# EAGLE design ramtotsop (EAGLE 9.6.2)
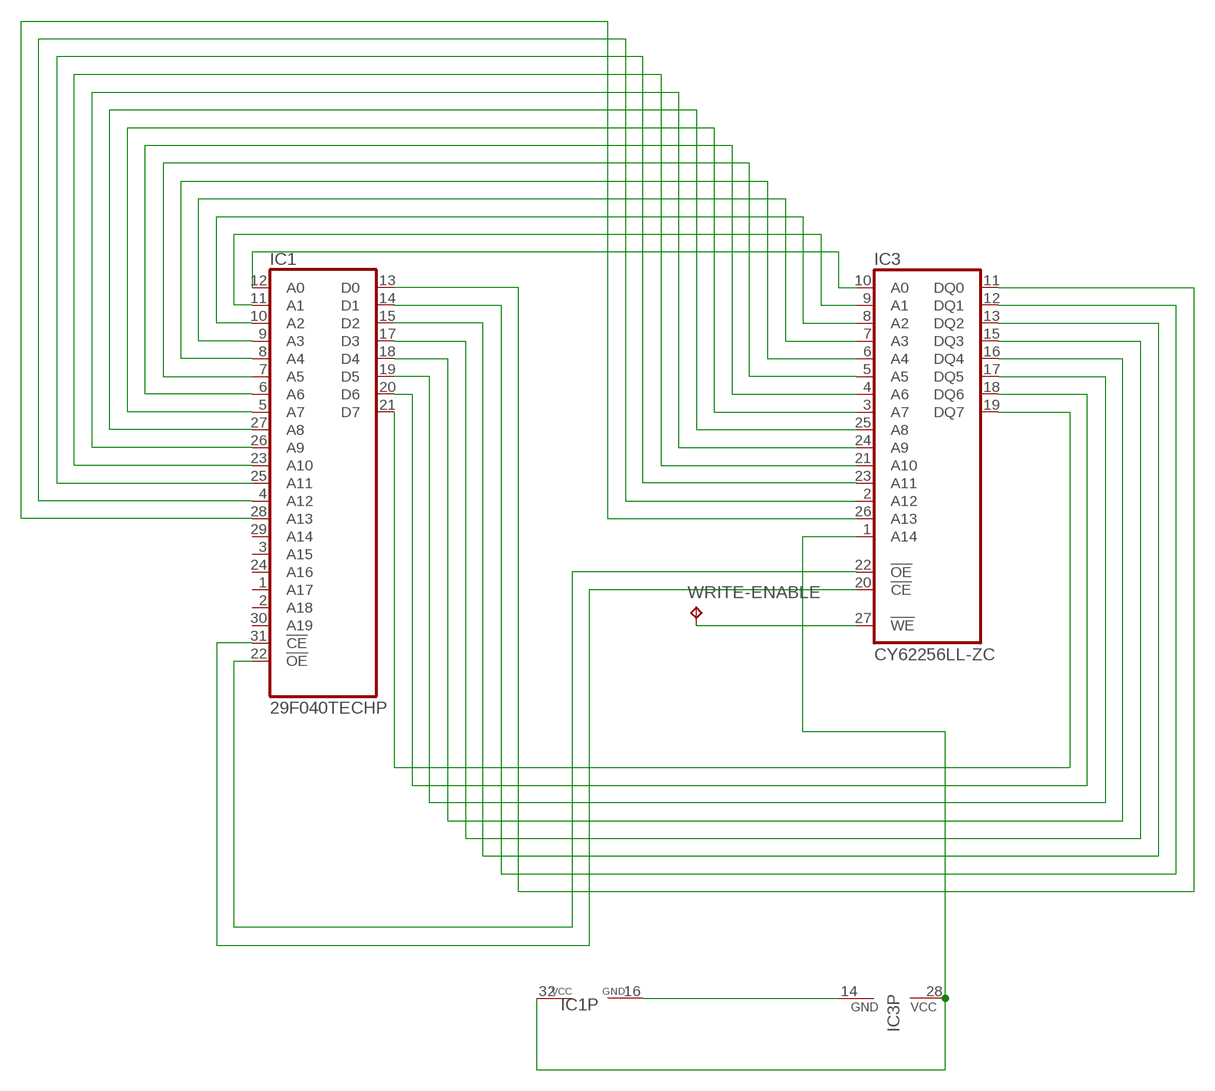
[diagram p0: schematic, sheet 1]

## Parts
IC1  29F040TECHP  [DIL32-3]
IC3  CY62256LL-ZC  [TSOP1-28]
WRITE-ENABLE  TPTP20SQ  [TP20SQ]

## Nets
CEROMPIN31: IC1.31(!CE) IC3.20(!CE)
MMC5-A0: IC1.12(A0) IC3.10(A0)
MMC5-A1: IC1.11(A1) IC3.9(A1)
MMC5-A2: IC1.10(A2) IC3.8(A2)
MMC5-A3: IC1.9(A3) IC3.7(A3)
MMC5-A4: IC1.8(A4) IC3.6(A4)
MMC5-A5: IC1.7(A5) IC3.5(A5)
MMC5-A6: IC1.6(A6) IC3.4(A6)
MMC5-A7: IC1.5(A7) IC3.3(A7)
MMC5-A8: IC1.27(A8) IC3.25(A8)
MMC5-A9: IC1.26(A9) IC3.24(A9)
MMC5-A10: IC1.23(A10) IC3.21(A10)
MMC5-A11: IC1.25(A11) IC3.23(A11)
MMC5-A12: IC1.4(A12) IC3.2(A12)
MMC5-A13: IC1.28(A13) IC3.26(A13)
MMC5-D0: IC1.13(D0) IC3.11(DQ0)
MMC5-D1: IC1.14(D1) IC3.12(DQ1)
MMC5-D2: IC1.15(D2) IC3.13(DQ2)
MMC5-D3: IC1.17(D3) IC3.15(DQ3)
MMC5-D4: IC1.18(D4) IC3.16(DQ4)
MMC5-D5: IC1.19(D5) IC3.17(DQ5)
MMC5-D6: IC1.20(D6) IC3.18(DQ6)
MMC5-D7: IC1.21(D7) IC3.19(DQ7)
MMC5-VCC: IC1.32(VCC) IC3.1(A14) IC3.28(VCC)
MMC5-VSS: IC1.16(GND) IC3.14(GND)
N$1: IC1.22(!OE) IC3.22(!OE)
WRITE-ENABLE: IC3.27(!WE) WRITE-ENABLE.TP
Unconnected: IC1.1(A17) IC1.2(A18) IC1.3(A15) IC1.24(A16) IC1.29(A14) IC1.30(A19)

## Library data of the parts
IC1 = MMC5:29F040: mmc5 rom
IC3 = issi-sram:CY62256LL-?*: 256K (32K x 8) CMOS-Static RAM Source: http://download.cypress.com.edgesuite.net/design_resources/datasheets/contents/cy62256_8.pdf
WRITE-ENABLE = testpad:TP: Test pad

## Board
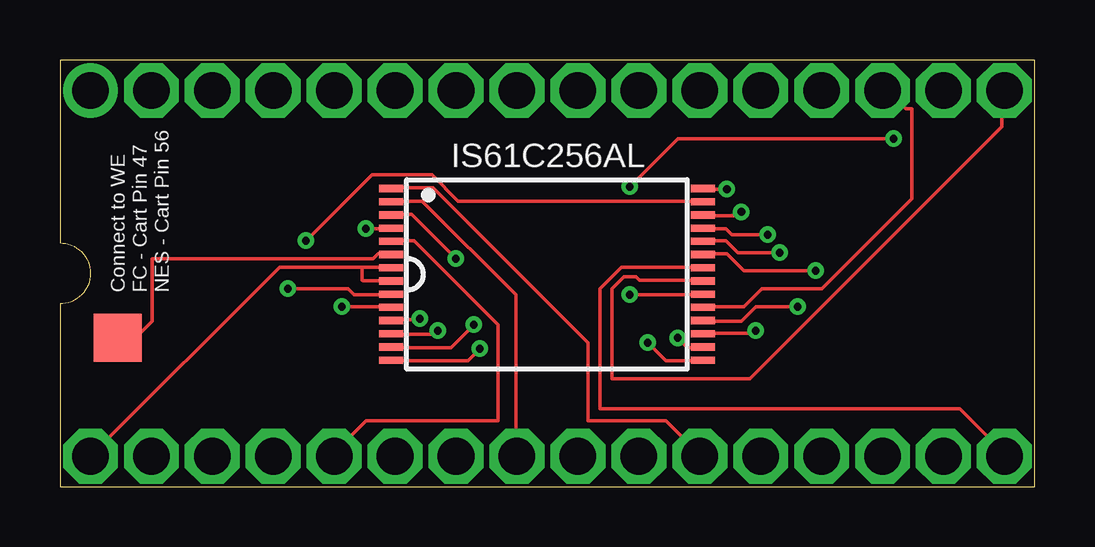
[diagram p1: board, top side]
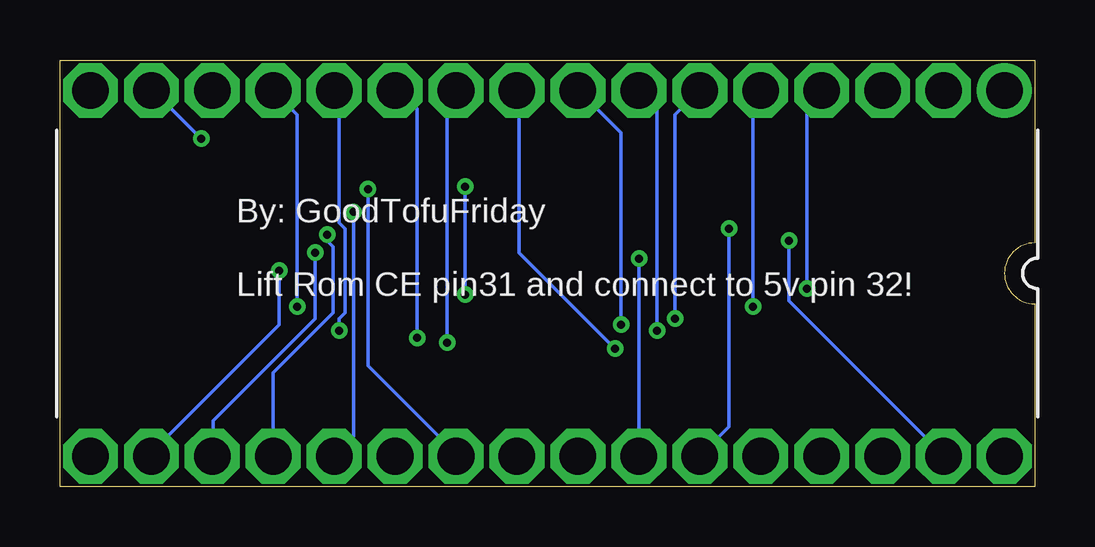
[diagram p2: board, bottom side, seen from below]

Size 40.64 x 17.78 mm. Coordinates in mm from the lower left corner, seen from the top.
Outline: 0,17.78 0,10.16 arc-180 0,7.62 0,0 40.64,0 40.64,17.78 0,17.78
Copper layers (1*16): Top 0.0356mm / dielectric 1.5011mm / Bottom 0.0356mm
Design rules "oshpark-2layer": minimum track width 6mil, minimum drill 13mil, track to track 6mil, track to pad 6mil, pad to pad 6mil, via to via 6mil, smd to smd 6mil, copper to edge 15mil, drill to drill 6mil, minimum pad ring 7mil, minimum via ring 7mil, stop-mask expansion 4mil, vias tented up to drill 0mil, thermal gap 10mil

### Footprints (pad centres in the part's own frame; a part is rotated, then mirrored left to right if it is on the bottom)
DIL32-3 = drill 1.524 pad 1.905: 1 -19.05,-7.62 | drill 1.524 pad 1.905 octagon: 2 -16.51,-7.62; 3 -13.97,-7.62; 4 -11.43,-7.62; 5 -8.89,-7.62; 6 -6.35,-7.62; 7 -3.81,-7.62; 8 -1.27,-7.62; 9 1.27,-7.62; 10 3.81,-7.62; 11 6.35,-7.62; 12 8.89,-7.62; 13 11.43,-7.62; 14 13.97,-7.62; 15 16.51,-7.62; 16 19.05,-7.62; 17 19.05,7.62; 18 16.51,7.62; 19 13.97,7.62; 20 11.43,7.62; 21 8.89,7.62; 22 6.35,7.62; 23 3.81,7.62; 24 1.27,7.62; 25 -1.27,7.62; 26 -3.81,7.62; 27 -6.35,7.62; 28 -8.89,7.62; 29 -11.43,7.62; 30 -13.97,7.62; 31 -16.51,7.62; 32 -19.05,7.62
TSOP1-28 = smd 1 x 0.3: 1 -6.5,-0.275; 2 -6.5,-0.825; 3 -6.5,-1.375; 4 -6.5,-1.925; 5 -6.5,-2.475; 6 -6.5,-3.025; 7 -6.5,-3.575; 8 6.5,-3.575; 9 6.5,-3.025; 10 6.5,-2.475; 11 6.5,-1.925; 12 6.5,-1.375; 13 6.5,-0.825; 14 6.5,-0.275; 15 6.5,0.275; 16 6.5,0.825; 17 6.5,1.375; 18 6.5,1.925; 19 6.5,2.475; 20 6.5,3.025; 21 6.5,3.575; 22 -6.5,3.575; 23 -6.5,3.025; 24 -6.5,2.475; 25 -6.5,1.925; 26 -6.5,1.375; 27 -6.5,0.825; 28 -6.5,0.275
TP20SQ = smd 2 x 2: TP 0,0

### Placement (x,y rotation side)
IC1  20.32,8.89 180 bottom
IC3  20.3,8.85 0 top
WRITE-ENABLE  2.4,6.2 0 top

### Tracks (layer width: path | path; a pad name or v marks a point on that pad's centre or on a via)
CEROMPIN31  (via drill 0.33)
  Top 0.152: v10.25,10.25 13,13 15.5,13 16.6,11.9 26.75,11.9 IC3.20
  Bottom 0.152: v10.25,10.25 10.25,7.75 4,1.5 IC1.31
MMC5-A0  (via drill 0.33)
  Top 0.152: v29,6.5 28.9,6.4 26.84,6.4 IC3.10
  Bottom 0.152: v29,6.5 29,7 28.75,7.25 28.75,10.75 29,11 29,16.5 IC1.12
MMC5-A1  (via drill 0.33)
  Top 0.152: v25.75,6.2 26.16,5.79 26.77,5.79 IC3.9
  Bottom 0.152: v25.75,6.2 25.75,15.75 26.5,16.5 IC1.11
MMC5-A2  (via drill 0.33)
  Top 0.152: v24.5,6 25.25,5.25 26.75,5.25 IC3.8
  Bottom 0.152: v24.5,6 24.5,16.25 24.25,16.5 IC1.10
MMC5-A3  (via drill 0.33)
  Top 0.152: v17.5,5.75 17,5.25 14,5.25 IC3.7
  Bottom 0.152: v17.5,5.75 21.5,9.75 21.5,16.5 IC1.9
MMC5-A4  (via drill 0.33)
  Top 0.152: v17.25,6.75 16.3,5.8 13.87,5.8 IC3.6
  Bottom 0.152: v17.25,6.75 17.25,14.75 19,16.5 IC1.8
MMC5-A5  (via drill 0.33)
  Top 0.152: v15.75,6.5 15.6,6.35 13.84,6.35 IC3.5
  Bottom 0.152: v15.75,6.5 15.75,15.75 IC1.7
MMC5-A6  (via drill 0.33)
  Top 0.152: v15,7 14.95,6.95 13.87,6.95 IC3.4
  Bottom 0.152: v15,7 15,15.5 14,16.5 IC1.6
MMC5-A7  (via drill 0.33)
  Top 0.152: v11.75,7.5 13.75,7.5 IC3.3
  Bottom 0.152: v11.75,7.5 11.75,16.25 11.5,16.5 IC1.5
MMC5-A8  (via drill 0.33)
  Top 0.152: v12.75,10.75 13.75,10.75 IC3.25
  Bottom 0.152: v12.75,10.75 12.75,2.5 13.75,1.5 IC1.27
MMC5-A9  (via drill 0.33)
  Top 0.152: IC3.24 13.82,11.35 14.65,11.35 v16.5,9.5
  Bottom 0.152: v16.5,9.5 16.5,1.5 IC1.26
MMC5-A10  (via drill 0.33)
  Top 0.152: IC3.21 26.82,12.4 v27.8,12.4
  Bottom 0.152: v27.8,12.4 27.8,5.05 24.25,1.5 IC1.23
MMC5-A11
  Top 0.152: IC3.23 13.82,11.9 15.1,11.9 19,8 19,1.5 IC1.25
MMC5-A12  (via drill 0.33)
  Top 0.152: v9.5,8.25 12,8.25 12.25,8 13.75,8 IC3.2
  Bottom 0.152: v9.5,8.25 9.5,16 9,16.5 IC1.4
MMC5-A13
  Top 0.152: IC3.26 14,10.25 14.75,10.25 18.25,6.75 18.25,2.75 12.75,2.75 11.5,1.5 IC1.28
MMC5-D0  (via drill 0.33)
  Top 0.152: IC3.11 26.82,6.9 28.4,6.9 29,7.5 v30.75,7.5
  Bottom 0.152: v30.75,7.5 30.75,15.5 IC1.13
MMC5-D1
  Top 0.152: IC3.12 27,7.5 28.5,7.5 29.25,8.25 31.75,8.25 35.5,12 35.5,15.75 35.25,15.75 34.5,16.5 IC1.14
MMC5-D2  (via drill 0.33)
  Top 0.152: v23.75,8 26.75,8 IC3.13 | v23.75,12.5 25.75,14.5 v34.75,14.5
  Bottom 0.152: v23.75,12.5 v23.75,8 | v34.75,14.5 36.75,16.5 IC1.15
MMC5-D3
  Top 0.152: IC3.15 26.79,9.15 23.4,9.15 22.5,8.25 22.5,3.25 37.5,3.25 39.25,1.5 IC1.17
MMC5-D4  (via drill 0.33)
  Top 0.152: v31.5,9 28.5,9 27.8,9.7 26.87,9.7 IC3.16
  Bottom 0.152: v31.5,9 31.5,6.75 36.75,1.5 IC1.18
MMC5-D5  (via drill 0.33)
  Top 0.152: v30,9.75 28.25,9.75 27.75,10.25 27,10.25 IC3.17
  Bottom 0.152: v30,9.75 30,7 34.25,2.75 34.25,1.5 IC1.19
MMC5-D6  (via drill 0.33)
  Top 0.152: v29.5,10.5 28,10.5 27.75,10.75 27,10.75 IC3.18
  Bottom 0.152: v29.5,10.5 29.5,10.25 29.25,10 29.25,7.25 31.75,4.75 IC1.20
MMC5-D7  (via drill 0.33)
  Top 0.152: v28.4,11.45 28.25,11.3 26.87,11.3 IC3.19
  Bottom 0.152: v28.4,11.45 28.4,2.1 29,1.5 IC1.21
MMC5-VCC
  Top 0.152: 12.65,9.15 9.15,9.15 IC1.32 | 12.65,9.15 13.75,9.15 13.79,9.13 IC3.28 | 12.65,9.15 12.6,9.1 12.6,8.6 12.62,8.57 IC3.1
MMC5-VSS
  Top 0.152: IC3.14 26.77,8.6 24.15,8.6 24,8.75 23.5,8.75 23,8.25 23,4.5 28.75,4.5 39.25,15 39.25,16.5 IC1.16
N$1
  Top 0.152: IC3.22 13.87,12.45 15.55,12.45 22,6 22,2.75 25.25,2.75 26.5,1.5 IC1.22
WRITE-ENABLE
  Top 0.152: IC3.27 13.78,9.7 13.25,9.7 13.05,9.5 5.1,9.5 5,9.5 3.85,9.5 3.85,6.9 3.15,6.2 WRITE-ENABLE.TP

### Text on the board
tNames: IS61C256AL | Connect to WE / FC - Cart Pin 47 / NES - Cart Pin 56
bNames: By: GoodTofuFriday / / Lift Rom CE pin31 and connect to 5v pin 32!